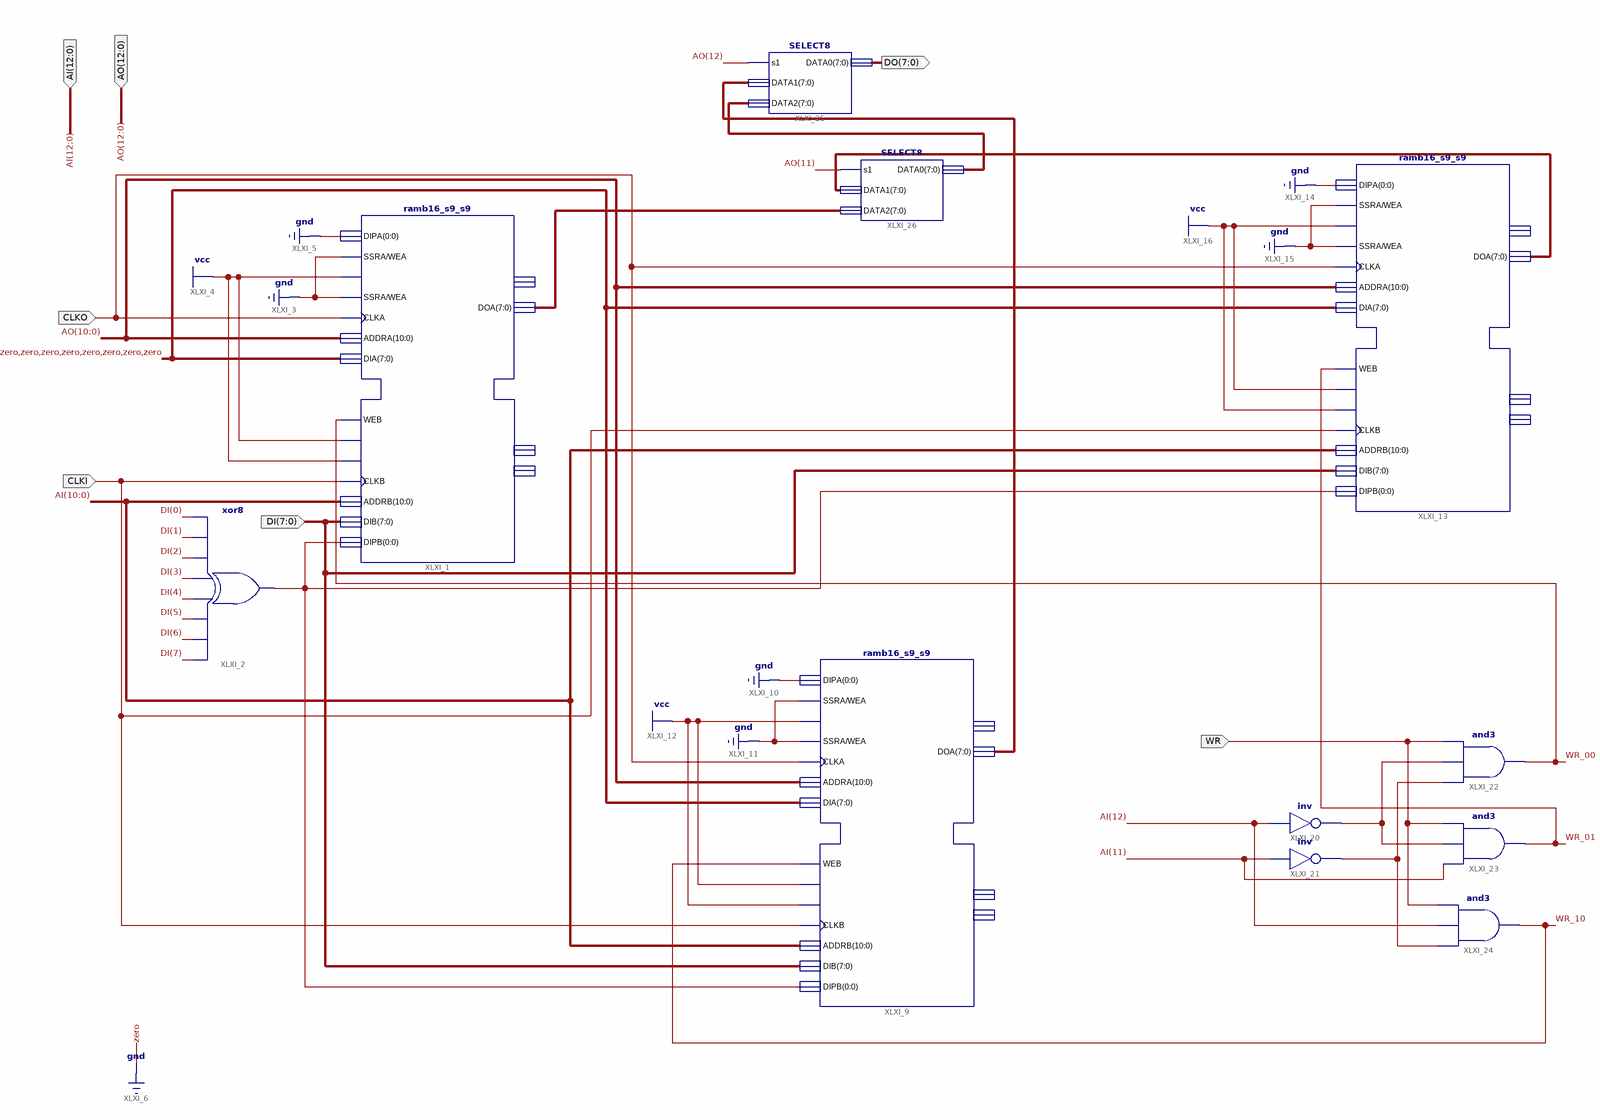
[diagram p0: schematic sheet 1]
// Xilinx ISE schematic PALETTE_RAM.sch (spartan3e) as structural Verilog: 11 symbols, 7 ports
module PALETTE_RAM (
  input  [7:0] DI,
  input  CLKI,
  input  CLKO,
  input  WR,
  input  [12:0] AI,
  input  [12:0] AO,
  output [7:0] DO
);

  wire WR_00, WR_01, WR_10, XLXN_47, XLXN_53;
  wire [0:0] XLXN_1;
  wire [7:0] XLXN_76, XLXN_77, XLXN_78, XLXN_79;

  ramb16_s9_s9 XLXI_1 (
    .ADDRA(AO[10:0]), .ADDRB(AI[10:0]), .CLKA(CLKO), .CLKB(CLKI), .DIA({8{1'b0}}), .DIB(DI), .DIPA(1'b0),
    .DIPB(XLXN_1[0]), .ENA(1'b1), .ENB(1'b1), .SSRA(1'b0), .SSRB(1'b1), .WEA(1'b0), .WEB(WR_00), .DOA(XLXN_78));  // open: DOB, DOPA, DOPB
  xor XLXI_2 (XLXN_1[0], DI[7], DI[6], DI[5], DI[4], DI[3], DI[2], DI[1], DI[0]);
  ramb16_s9_s9 XLXI_9 (
    .ADDRA(AO[10:0]), .ADDRB(AI[10:0]), .CLKA(CLKO), .CLKB(CLKI), .DIA({8{1'b0}}), .DIB(DI), .DIPA(1'b0),
    .DIPB(XLXN_1[0]), .ENA(1'b1), .ENB(1'b1), .SSRA(1'b0), .SSRB(1'b1), .WEA(1'b0), .WEB(WR_10), .DOA(XLXN_76));  // open: DOB, DOPA, DOPB
  ramb16_s9_s9 XLXI_13 (
    .ADDRA(AO[10:0]), .ADDRB(AI[10:0]), .CLKA(CLKO), .CLKB(CLKI), .DIA({8{1'b0}}), .DIB(DI), .DIPA(1'b0),
    .DIPB(XLXN_1[0]), .ENA(1'b1), .ENB(1'b1), .SSRA(1'b0), .SSRB(1'b1), .WEA(1'b0), .WEB(WR_01), .DOA(XLXN_79));  // open: DOB, DOPA, DOPB
  not XLXI_20 (XLXN_53, AI[12]);
  not XLXI_21 (XLXN_47, AI[11]);
  and XLXI_22 (WR_00, XLXN_47, XLXN_53, WR);
  and XLXI_23 (WR_01, AI[11], XLXN_53, WR);
  and XLXI_24 (WR_10, XLXN_47, AI[12], WR);
  SELECT8 XLXI_25 (.s1(AO[12]), .DATA1(XLXN_76), .DATA2(XLXN_77), .DATA0(DO));
  SELECT8 XLXI_26 (.s1(AO[11]), .DATA1(XLXN_79), .DATA2(XLXN_78), .DATA0(XLXN_77));
endmodule
